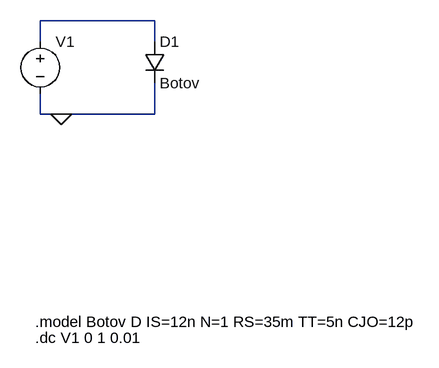
[diagram p0: schematic task_1.asc]
task_1.asc, the LTspice schematic file:
Version 4
SHEET 1 1044 680
WIRE 272 -160 96 -160
WIRE 96 -128 96 -160
WIRE 272 -128 272 -160
WIRE 96 -16 96 -48
WIRE 128 -16 96 -16
WIRE 272 -16 272 -64
WIRE 272 -16 128 -16
FLAG 128 -16 0
SYMBOL voltage 96 -144 R0
WINDOW 123 0 0 Left 2
WINDOW 39 0 0 Left 2
SYMATTR InstName V1
SYMATTR Value ""
SYMBOL diode 256 -128 R0
SYMATTR InstName D1
SYMATTR Value Botov
TEXT 88 304 Left 2 !.model Botov D IS=12n N=1 RS=35m TT=5n CJO=12p
TEXT 88 328 Left 2 !.dc V1 0 1 0.01

The netlist it stands for:
* task_1.asc
V1 N001 0
D1 N001 0 Botov
.model D D
.lib standard.dio
.model Botov D IS=12n N=1 RS=35m TT=5n CJO=12p
.dc V1 0 1 0.01
.backanno
.end